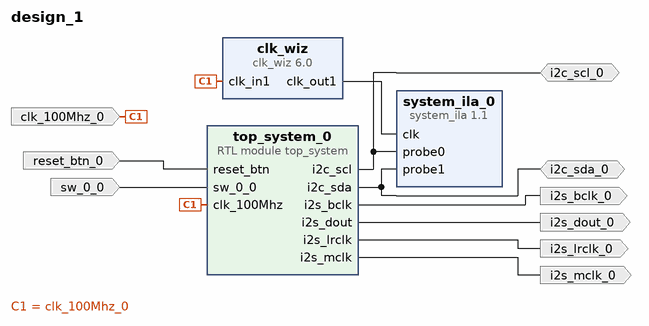
[diagram p0: block diagram of the top level]
# Vivado block design design_1, xc7a100tcsg324-1, Vivado 2025.1
create_bd_design design_1

create_bd_port -dir I clk_100Mhz_0
create_bd_port -dir IO i2c_scl_0
create_bd_port -dir IO i2c_sda_0
create_bd_port -dir O i2s_bclk_0
create_bd_port -dir O i2s_dout_0
create_bd_port -dir O i2s_lrclk_0
create_bd_port -dir O i2s_mclk_0
create_bd_port -dir I -type rst reset_btn_0
create_bd_port -dir I sw_0_0

create_bd_cell -type module -reference top_system top_system_0
create_bd_cell -type ip -vlnv xilinx.com:ip:clk_wiz:6.0 clk_wiz
set_property -dict {CONFIG.CLKOUT1_REQUESTED_OUT_FREQ 100.0 CONFIG.USE_RESET false} [get_bd_cells clk_wiz]
create_bd_cell -type ip -vlnv xilinx.com:ip:system_ila:1.1 system_ila_0
set_property -dict [list \
  CONFIG.C_MON_TYPE NATIVE \
  CONFIG.C_NUM_OF_PROBES 2 \
  CONFIG.C_PROBE0_TYPE 0 \
  CONFIG.C_PROBE1_TYPE 0 \
] [get_bd_cells system_ila_0]

# ---- connections ----

connect_bd_net -net Net [get_bd_ports i2c_scl_0] [get_bd_pins top_system_0/i2c_scl] [get_bd_pins system_ila_0/probe0]
connect_bd_net -net Net1 [get_bd_ports i2c_sda_0] [get_bd_pins top_system_0/i2c_sda] [get_bd_pins system_ila_0/probe1]
connect_bd_net -net clk_100Mhz_0_1 [get_bd_ports clk_100Mhz_0] [get_bd_pins clk_wiz/clk_in1] [get_bd_pins top_system_0/clk_100Mhz]
connect_bd_net [get_bd_pins clk_wiz/clk_out1] [get_bd_pins system_ila_0/clk]
connect_bd_net -net reset_btn_0_1 [get_bd_ports reset_btn_0] [get_bd_pins top_system_0/reset_btn]
connect_bd_net -net sw_0_0_1 [get_bd_ports sw_0_0] [get_bd_pins top_system_0/sw_0_0]
connect_bd_net [get_bd_pins top_system_0/i2s_bclk] [get_bd_ports i2s_bclk_0]
connect_bd_net [get_bd_pins top_system_0/i2s_dout] [get_bd_ports i2s_dout_0]
connect_bd_net [get_bd_pins top_system_0/i2s_lrclk] [get_bd_ports i2s_lrclk_0]
connect_bd_net [get_bd_pins top_system_0/i2s_mclk] [get_bd_ports i2s_mclk_0]
set_property HDL_ATTRIBUTE.DEBUG true [get_bd_nets Net]
set_property HDL_ATTRIBUTE.MARK_DEBUG true [get_bd_nets Net]
set_property HDL_ATTRIBUTE.DEBUG true [get_bd_nets Net1]
set_property HDL_ATTRIBUTE.MARK_DEBUG true [get_bd_nets Net1]

validate_bd_design
save_bd_design
